# Altium schematic sheet 18_DDR3_TOP.SchDoc: DDR3 top
size A3; Organization: Lime Microsystems; Address1: Surrey Tech Centre; Address2: Guildford GU2 7YG; Address3: Surrey; Address4: United Kingdom; Revision: v1.2; SheetNumber: 16; SheetTotal: 27
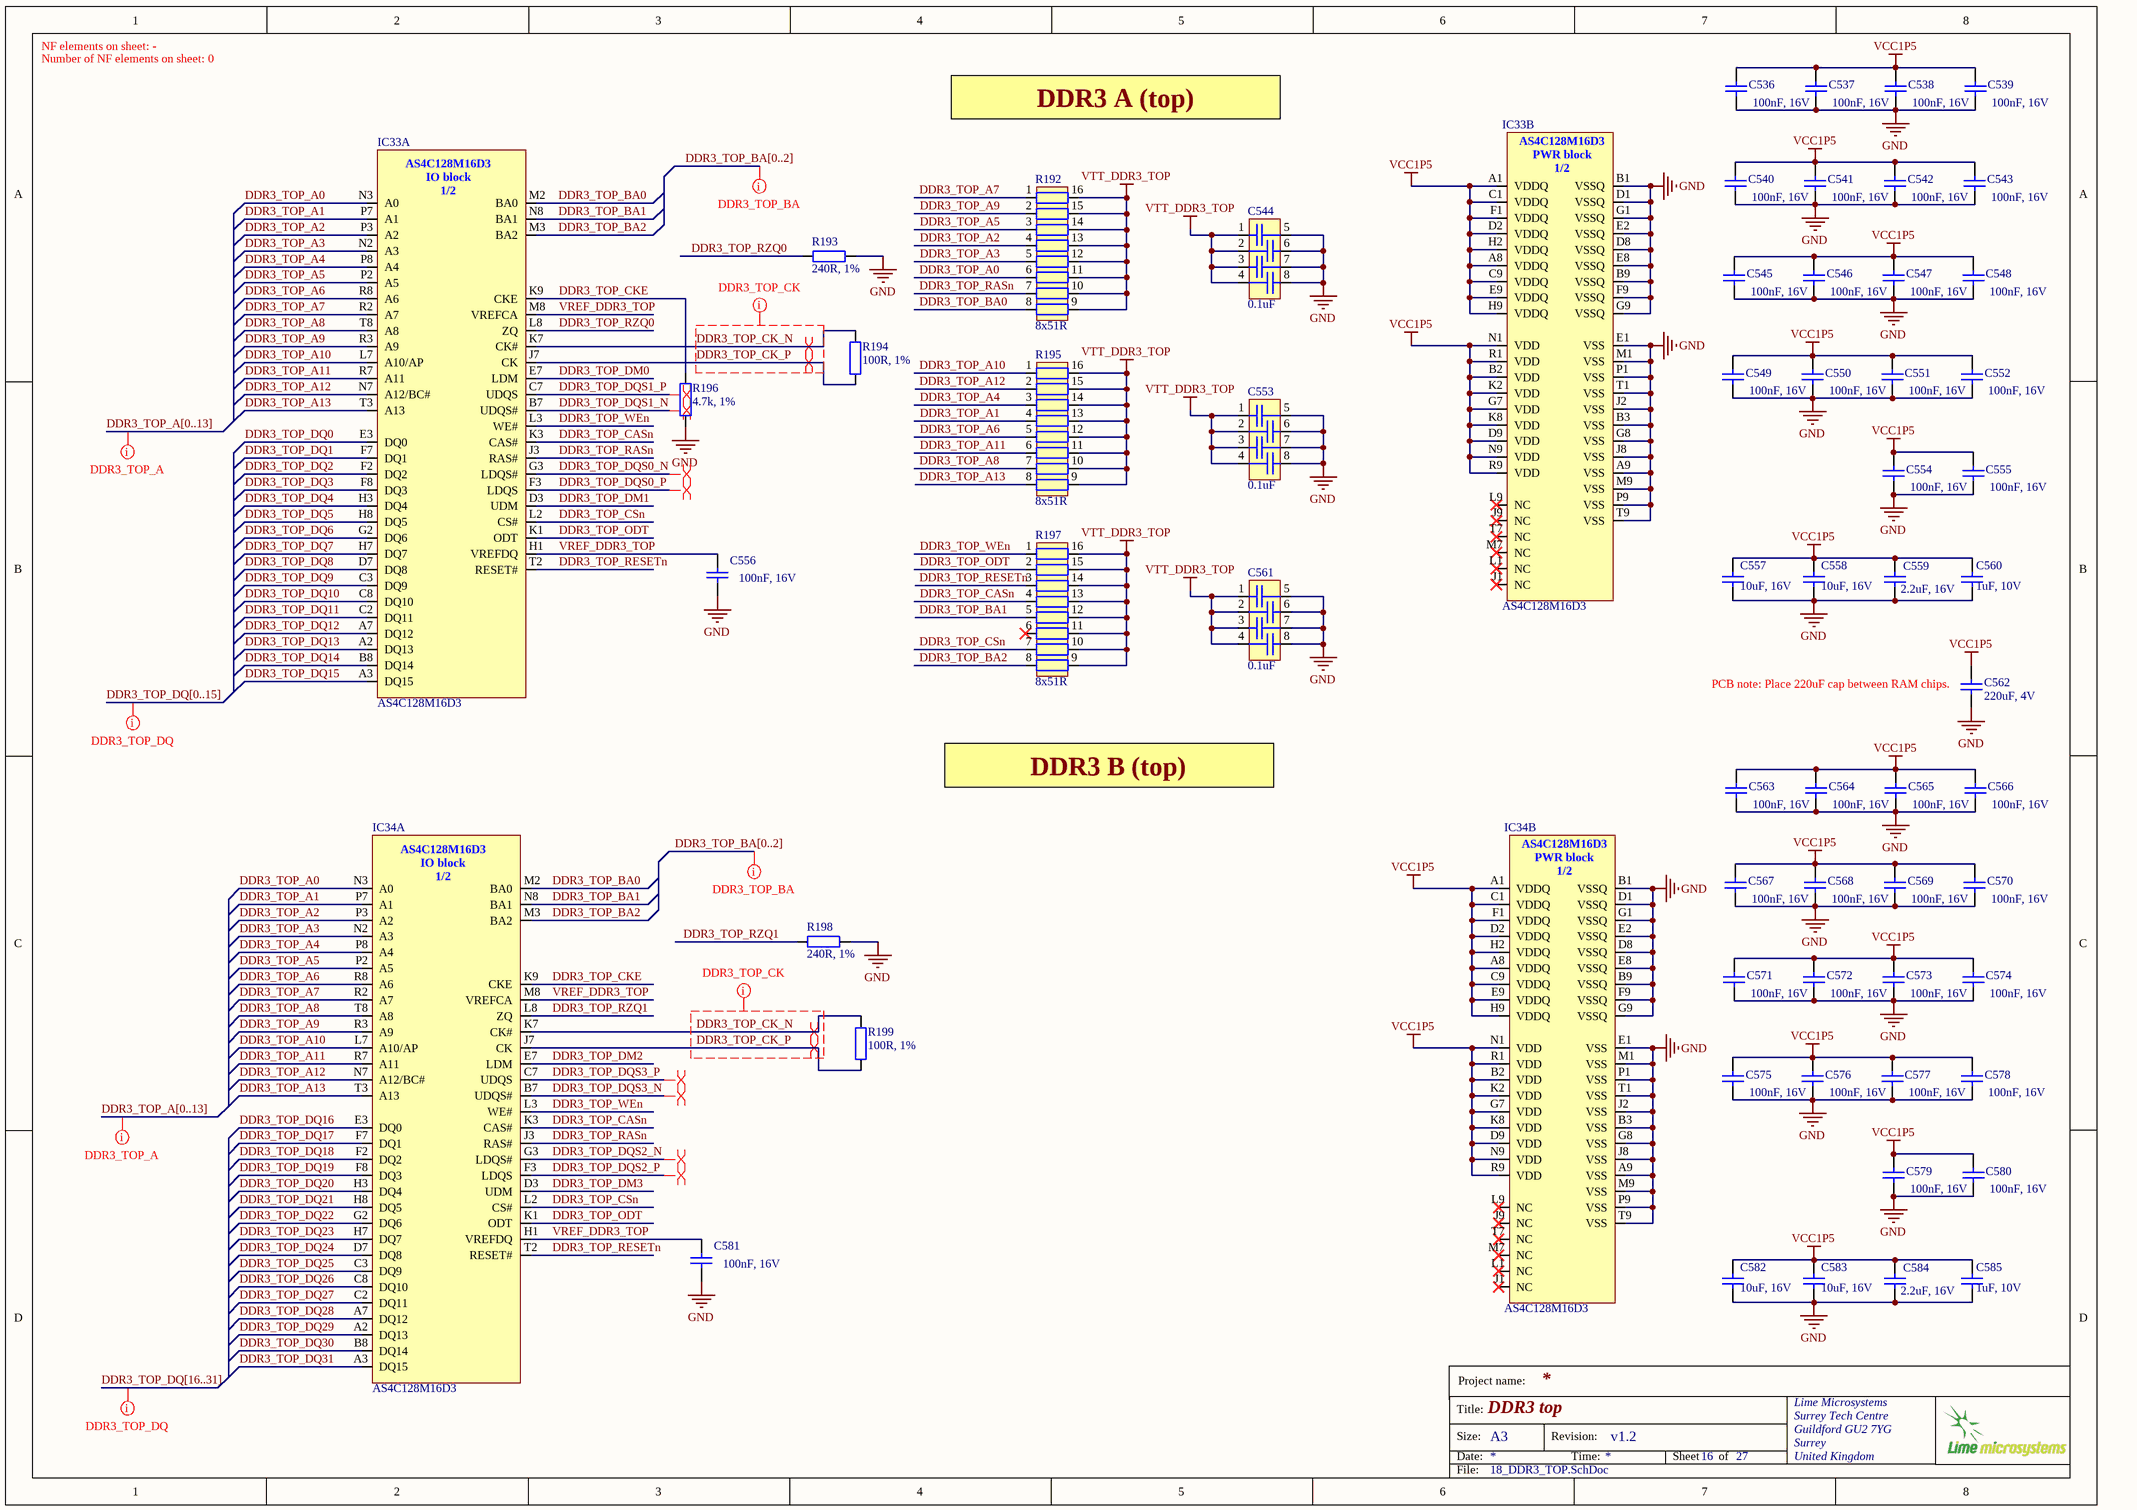
[diagram p0: 18_DDR3_TOP.SchDoc]

## Parts
C536  100nF, 16V  [CAP0402]
C537  100nF, 16V  [CAP0402]
C538  100nF, 16V  [CAP0402]
C539  100nF, 16V  [CAP0402]
C540  100nF, 16V  [CAP0402]
C541  100nF, 16V  [CAP0402]
C542  100nF, 16V  [CAP0402]
C543  100nF, 16V  [CAP0402]
C544  0.1uF  [CKCA43X7R1C104M100AA]
C545  100nF, 16V  [CAP0402]
C546  100nF, 16V  [CAP0402]
C547  100nF, 16V  [CAP0402]
C548  100nF, 16V  [CAP0402]
C549  100nF, 16V  [CAP0402]
C550  100nF, 16V  [CAP0402]
C551  100nF, 16V  [CAP0402]
C552  100nF, 16V  [CAP0402]
C553  0.1uF  [CKCA43X7R1C104M100AA]
C554  100nF, 16V  [CAP0402]
C555  100nF, 16V  [CAP0402]
C556  100nF, 16V  [CAP0402]
C557  10uF, 16V  [CAP0603]
C558  10uF, 16V  [CAP0603]
C559  2.2uF, 16V  [CAP0402]
C560  1uF, 10V  [CAP0402]
C561  0.1uF  [CKCA43X7R1C104M100AA]
C562  220uF, 4V  [CAP1206]
C563  100nF, 16V  [CAP0402]
C564  100nF, 16V  [CAP0402]
C565  100nF, 16V  [CAP0402]
C566  100nF, 16V  [CAP0402]
C567  100nF, 16V  [CAP0402]
C568  100nF, 16V  [CAP0402]
C569  100nF, 16V  [CAP0402]
C570  100nF, 16V  [CAP0402]
C571  100nF, 16V  [CAP0402]
C572  100nF, 16V  [CAP0402]
C573  100nF, 16V  [CAP0402]
C574  100nF, 16V  [CAP0402]
C575  100nF, 16V  [CAP0402]
C576  100nF, 16V  [CAP0402]
C577  100nF, 16V  [CAP0402]
C578  100nF, 16V  [CAP0402]
C579  100nF, 16V  [CAP0402]
C580  100nF, 16V  [CAP0402]
C581  100nF, 16V  [CAP0402]
C582  10uF, 16V  [CAP0603]
C583  10uF, 16V  [CAP0603]
C584  2.2uF, 16V  [CAP0402]
C585  1uF, 10V  [CAP0402]
IC33  AS4C128M16D3  [AS4C128M16D3]  (parts A,B of 2)
IC34  AS4C128M16D3  [AS4C128M16D3]  (parts A,B of 2)
R192  8x51R  [EXB2HV]
R193  240R, 1%  [RES0402]
R194  100R, 1%  [RES0402]
R195  8x51R  [EXB2HV]
R196  4.7k, 1%  [RES0402]
R197  8x51R  [EXB2HV]
R198  240R, 1%  [RES0402]
R199  100R, 1%  [RES0402]

## Nets
GND: C536.2 C537.2 C538.2 C539.2 C540.2 C541.2 C542.2 C543.2 C544.5 C544.6 C544.7 C544.8 C545.2 C546.2 C547.2 C548.2 C549.2 C550.2 C551.2 C552.2 C553.5 C553.6 C553.7 C553.8 C554.2 C555.2 C556.2 C557.1 C558.1 C559.2 C560.1 C561.5 C561.6 C561.7 C561.8 C562.1 C563.2 C564.2 C565.2 C566.2 C567.2 C568.2 C569.2 C570.2 C571.2 C572.2 C573.2 C574.2 C575.2 C576.2 C577.2 C578.2 C579.2 C580.2 C581.2 C582.1 C583.1 C584.2 C585.1 IC33.A9(VSS) IC33.B1(VSSQ) IC33.B3(VSS) IC33.B9(VSSQ) IC33.D1(VSSQ) IC33.D8(VSSQ) IC33.E1(VSS) IC33.E2(VSSQ) IC33.E8(VSSQ) IC33.F9(VSSQ) IC33.G1(VSSQ) IC33.G8(VSS) IC33.G9(VSSQ) IC33.J2(VSS) IC33.J8(VSS) IC33.M1(VSS) IC33.M9(VSS) IC33.P1(VSS) IC33.P9(VSS) IC33.T1(VSS) IC33.T9(VSS) IC34.A9(VSS) IC34.B1(VSSQ) IC34.B3(VSS) IC34.B9(VSSQ) IC34.D1(VSSQ) IC34.D8(VSSQ) IC34.E1(VSS) IC34.E2(VSSQ) IC34.E8(VSSQ) IC34.F9(VSSQ) IC34.G1(VSSQ) IC34.G8(VSS) IC34.G9(VSSQ) IC34.J2(VSS) IC34.J8(VSS) IC34.M1(VSS) IC34.M9(VSS) IC34.P1(VSS) IC34.P9(VSS) IC34.T1(VSS) IC34.T9(VSS) R193.2 R196.2 R198.2
VCC1P5: C536.1 C537.1 C538.1 C539.1 C540.1 C541.1 C542.1 C543.1 C545.1 C546.1 C547.1 C548.1 C549.1 C550.1 C551.1 C552.1 C554.1 C555.1 C557.2 C558.2 C559.1 C560.2 C562.2 C563.1 C564.1 C565.1 C566.1 C567.1 C568.1 C569.1 C570.1 C571.1 C572.1 C573.1 C574.1 C575.1 C576.1 C577.1 C578.1 C579.1 C580.1 C582.2 C583.2 C584.1 C585.2 IC33.A1(VDDQ) IC33.A8(VDDQ) IC33.B2(VDD) IC33.C1(VDDQ) IC33.C9(VDDQ) IC33.D2(VDDQ) IC33.D9(VDD) IC33.E9(VDDQ) IC33.F1(VDDQ) IC33.G7(VDD) IC33.H2(VDDQ) IC33.H9(VDDQ) IC33.K2(VDD) IC33.K8(VDD) IC33.N1(VDD) IC33.N9(VDD) IC33.R1(VDD) IC33.R9(VDD) IC34.A1(VDDQ) IC34.A8(VDDQ) IC34.B2(VDD) IC34.C1(VDDQ) IC34.C9(VDDQ) IC34.D2(VDDQ) IC34.D9(VDD) IC34.E9(VDDQ) IC34.F1(VDDQ) IC34.G7(VDD) IC34.H2(VDDQ) IC34.H9(VDDQ) IC34.K2(VDD) IC34.K8(VDD) IC34.N1(VDD) IC34.N9(VDD) IC34.R1(VDD) IC34.R9(VDD)
VTT_DDR3_TOP: C544.1 C544.2 C544.3 C544.4 C553.1 C553.2 C553.3 C553.4 C561.1 C561.2 C561.3 C561.4 R192.9 R192.10 R192.11 R192.12 R192.13 R192.14 R192.15 R192.16 R195.9 R195.10 R195.11 R195.12 R195.13 R195.14 R195.15 R195.16 R197.9 R197.10 R197.11 R197.12 R197.13 R197.14 R197.15 R197.16
DDR3_TOP_A0: IC33.N3(A0) IC34.N3(A0) R192.6
DDR3_TOP_A1: IC33.P7(A1) IC34.P7(A1) R195.4
DDR3_TOP_A2: IC33.P3(A2) IC34.P3(A2) R192.4
DDR3_TOP_A3: IC33.N2(A3) IC34.N2(A3) R192.5
DDR3_TOP_A4: IC33.P8(A4) IC34.P8(A4) R195.3
DDR3_TOP_A5: IC33.P2(A5) IC34.P2(A5) R192.3
DDR3_TOP_A6: IC33.R8(A6) IC34.R8(A6) R195.5
DDR3_TOP_A7: IC33.R2(A7) IC34.R2(A7) R192.1
DDR3_TOP_A8: IC33.T8(A8) IC34.T8(A8) R195.7
DDR3_TOP_A9: IC33.R3(A9) IC34.R3(A9) R192.2
DDR3_TOP_A10: IC33.L7(A10/AP) IC34.L7(A10/AP) R195.1
DDR3_TOP_A11: IC33.R7(A11) IC34.R7(A11) R195.6
DDR3_TOP_A12: IC33.N7(A12/BC#) IC34.N7(A12/BC#) R195.2
DDR3_TOP_A13: IC33.T3(A13) IC34.T3(A13) R195.8
DDR3_TOP_BA0: IC33.M2(BA0) IC34.M2(BA0) R192.8
DDR3_TOP_BA1: IC33.N8(BA1) IC34.N8(BA1) R197.5
DDR3_TOP_BA2: IC33.M3(BA2) IC34.M3(BA2) R197.8
DDR3_TOP_CASn: IC33.K3(CAS#) IC34.K3(CAS#) R197.4
DDR3_TOP_CK_N: IC33.K7(CK#) IC34.K7(CK#) R194.2 R199.2
DDR3_TOP_CK_P: IC33.J7(CK) IC34.J7(CK) R194.1 R199.1
DDR3_TOP_CKE: IC33.K9(CKE) IC34.K9(CKE) R196.1
DDR3_TOP_CSn: IC33.L2(CS#) IC34.L2(CS#) R197.7
DDR3_TOP_DM0: IC33.E7(LDM)
DDR3_TOP_DM1: IC33.D3(UDM)
DDR3_TOP_DM2: IC34.E7(LDM)
DDR3_TOP_DM3: IC34.D3(UDM)
DDR3_TOP_DQ0: IC33.E3(DQ0)
DDR3_TOP_DQ1: IC33.F7(DQ1)
DDR3_TOP_DQ2: IC33.F2(DQ2)
DDR3_TOP_DQ3: IC33.F8(DQ3)
DDR3_TOP_DQ4: IC33.H3(DQ4)
DDR3_TOP_DQ5: IC33.H8(DQ5)
DDR3_TOP_DQ6: IC33.G2(DQ6)
DDR3_TOP_DQ7: IC33.H7(DQ7)
DDR3_TOP_DQ8: IC33.D7(DQ8)
DDR3_TOP_DQ9: IC33.C3(DQ9)
DDR3_TOP_DQ10: IC33.C8(DQ10)
DDR3_TOP_DQ11: IC33.C2(DQ11)
DDR3_TOP_DQ12: IC33.A7(DQ12)
DDR3_TOP_DQ13: IC33.A2(DQ13)
DDR3_TOP_DQ14: IC33.B8(DQ14)
DDR3_TOP_DQ15: IC33.A3(DQ15)
DDR3_TOP_DQ16: IC34.E3(DQ0)
DDR3_TOP_DQ17: IC34.F7(DQ1)
DDR3_TOP_DQ18: IC34.F2(DQ2)
DDR3_TOP_DQ19: IC34.F8(DQ3)
DDR3_TOP_DQ20: IC34.H3(DQ4)
DDR3_TOP_DQ21: IC34.H8(DQ5)
DDR3_TOP_DQ22: IC34.G2(DQ6)
DDR3_TOP_DQ23: IC34.H7(DQ7)
DDR3_TOP_DQ24: IC34.D7(DQ8)
DDR3_TOP_DQ25: IC34.C3(DQ9)
DDR3_TOP_DQ26: IC34.C8(DQ10)
DDR3_TOP_DQ27: IC34.C2(DQ11)
DDR3_TOP_DQ28: IC34.A7(DQ12)
DDR3_TOP_DQ29: IC34.A2(DQ13)
DDR3_TOP_DQ30: IC34.B8(DQ14)
DDR3_TOP_DQ31: IC34.A3(DQ15)
DDR3_TOP_DQS0_N: IC33.G3(LDQS#)
DDR3_TOP_DQS0_P: IC33.F3(LDQS)
DDR3_TOP_DQS1_N: IC33.B7(UDQS#)
DDR3_TOP_DQS1_P: IC33.C7(UDQS)
DDR3_TOP_DQS2_N: IC34.G3(LDQS#)
DDR3_TOP_DQS2_P: IC34.F3(LDQS)
DDR3_TOP_DQS3_N: IC34.B7(UDQS#)
DDR3_TOP_DQS3_P: IC34.C7(UDQS)
DDR3_TOP_ODT: IC33.K1(ODT) IC34.K1(ODT) R197.2
DDR3_TOP_RASn: IC33.J3(RAS#) IC34.J3(RAS#) R192.7
DDR3_TOP_RESETn: IC33.T2(RESET#) IC34.T2(RESET#) R197.3
DDR3_TOP_RZQ0: IC33.L8(ZQ) R193.1
DDR3_TOP_RZQ1: IC34.L8(ZQ) R198.1
DDR3_TOP_WEn: IC33.L3(WE#) IC34.L3(WE#) R197.1
VREF_DDR3_TOP: C556.1 C581.1 IC33.H1(VREFDQ) IC33.M8(VREFCA) IC34.H1(VREFDQ) IC34.M8(VREFCA)

Not connected (* = marked no-connect by the designer): IC33 J1(NC)* J9(NC)* L1(NC)* L9(NC)* M7(NC)* T7(NC)*; IC34 J1(NC)* J9(NC)* L1(NC)* L9(NC)* M7(NC)* T7(NC)*; R197 6*

## Buses and harness runs
bus DDR3_TOP_A[0..13]
bus DDR3_TOP_BA[0..2]
bus DDR3_TOP_DQ[0..15]
bus DDR3_TOP_DQ[16..31]

## Layout directives
net class DDR3_TOP_DQ: (no net found under the mark)
net class DDR3_TOP_BA: (no net found under the mark)
net class DDR3_TOP_A: (no net found under the mark)
differential pair: DDR3_TOP_CK_N, DDR3_TOP_CK_P, DDR3_TOP_DQS0_N, DDR3_TOP_DQS0_P, DDR3_TOP_DQS1_N, DDR3_TOP_DQS1_P, DDR3_TOP_DQS2_N, DDR3_TOP_DQS2_P, DDR3_TOP_DQS3_N, DDR3_TOP_DQS3_P
net class DDR3_TOP_CK: (no net found under the mark), DDR3_TOP_CK_N, DDR3_TOP_CK_P

## Notes on the sheet
- NF elements on sheet: -
- Number of NF elements on sheet: 0
- DDR3 A (top)
- (near C562) PCB note: Place 220uF cap between RAM chips.
- DDR3 B (top)
- Project name:
- Title:
- Size:
- Date:
- A3
- Revision:
- Time:
- Sheet
- of
- File:
- (in symbol AS4C128M16D3, part A) AS4C128M16D3 / IO block / 1/2
- (in symbol AS4C128M16D3, part B) AS4C128M16D3 / PWR block / 1/2

## Library data of the parts
C536-C543 C545-C552 C554-C556 C563-C581 = Cap_0603: Part Description: 0.10µF ±10% 16V Ceramic Capacitor X7R 0402 (1005 Metric); Manufacturer Part Number 1: GRM155R71C104KA88D; Brand: Murata Electronics; Tolerance: 10 %; Type: General Purpose MLCC; Capacitance: 0.1 uF; Temperature Coefficient / Code: +/- 15 %; Case Height: 0.5 mm; Case Length: 1 mm; Dielectric: X7R; Supplier 1: Mouser; Supplier Part Number 1: 81-GRM155R71C104KA88; Case Code - in: 0402; Manufacturer: Murata Electronics; Category: Multilayer Ceramic Capacitors MLCC - SMD/SMT; Voltage Rating DC: 16 V; Value: 100nF, 16V; Case Code - mm: 1005; Case Width: 0.5 mm; Manufacturer Part Number: GRM155R71C104KA88D; Maximum Operating Temperature: + 125 C; Minimum Operating Temperature: - 55 C; Minimum Order Quantity: 1; Operating Temperature Range: - 55 C to + 125 C; Package / Case: 0402 (1005 metric); Packaging: Reel; Product: General Type MLCCs; Product Category: Low & Medium Capacitance SMD Ceramic Chip Capacitors; Reeling: True; RoHS - Mouser: Y; RoHS: RoHS Compliant; Series: GRM; Standard Pack Qty: 10000; Termination Style: SMD/SMT
C544 C553 C561 = 4X_cap_array_1206: Manufacturer: TDK; Part Description: 0.10µF ±20% Isolated Capacitor 4 Array 16V X7R 1206 (3216 Metric); Case Height: 1 mm; Case Length: 3.2 mm; Case Width: 1.6 mm; Voltage Rating: 16 V; Number of Elements: 4; Tolerance: 20 %; Temperature Coefficient / Code: X7R; Value: 0.1uF; Supplier 1: Mouser; Supplier Part Number 1: 810-CKCA43X7R1C104M; RoHS: RoHS Compliant; Termination Style: SMD/SMT; Brand: TDK; Category: Capacitor Arrays & Networks; Product: Ceramic Capacitor Arrays; Series: CKC; Packaging: Reel; Operating Temperature Range: - 55 C to + 125 C; Manufacturer Part Number 1: CKCA43X7R1C104M100AA; Capacitance: 0.1 uF; Product Category: Capacitor Arrays; Standard Pack Qty: 2000; RoHS - Mouser: Y; Minimum Order Quantity: 1; Reeling: True
C557 C558 C582 C583 = Cap_0603: Manufacturer Part Number 1: GRM188R61C106MA73D; Manufacturer: Yageo; Part Description: 10µF ±20% 16V Ceramic Capacitor X5R 0603 (1608 Metric); Capacitance: 10µF; Tolerance: ±20%; Temperature Coefficient: X5R; Supplier 1: Digi-Key; Supplier Part Number 1: 490-7201-2-ND; Package / Case: 0603 (1608 Metric); Category: Capacitors; Voltage - Rated: 16V; Value: 10uF, 16V; Applications: General Purpose; Features: -; Height - Seated (Max): -; Lead Spacing: -; Lead Style: -; Mounting Type: Surface Mount, MLCC; Operating Temperature: -55°C ~ 85°C; Packaging: Tape & Reel (TR); Ratings: -; RoHS: RoHS Compliant; Size / Dimension: 0.063" L x 0.031" W (1.60mm x 0.80mm); Thickness (Max): 0.039" (1.00mm)
C559 C584 = Cap_0603: CAP CER 2.2UF 16V 10% X5R 0402; Manufacturer Part Number 1: C1005X5R1C225K050BC; Part Description: 2.2µF ±10% 16V Ceramic Capacitor X5R 0402 (1005 Metric); Manufacturer: TDK Corporation; Capacitance: 2.2µF; Capacitor Case Style: 0402 [1005 Metric]; Value: 2.2uF, 16V; Supplier 1: Digi-Key; Supplier Part Number 1: 445-9085-6-ND; Tolerance: ±10%; Operating Temperature: -55°C ~ 85°C; Voltage - Rated: 16V; Category: Capacitors; Package / Case: 0402 (1005 Metric); Operating Temperature Range: -55°C to +85; Applications: General Purpose; Features: -; Height - Seated (Max): -; Lead Spacing: -; Lead Style: -; Mounting Type: Surface Mount, MLCC; Packaging: Tape & Reel (TR); Ratings: -; RoHS: RoHS Compliant; Size / Dimension: 0.039" L x 0.020" W (1.00mm x 0.50mm); Temperature Coefficient: X5R; Thickness (Max): 0.022" (0.55mm)
C560 C585 = Cap_0603: Manufacturer: TDK; Manufacturer Part Number 1: GRM155R61A105KE15J; Part Description: 1µF ±10% 10V Ceramic Capacitor X5R 0402 (1005 Metric); Capacitance: 1; Capacitance Tolerance: ± 10%; Ceramic Capacitor Case: 0402 [1005 Metric]; Dielectric Characteristic: X6; Product Range: TDK - C Series; Voltage Rating: 10; Supplier 1: Newark; Supplier Part Number 1: 490-6298-2-ND; Value: 1uF, 10V; MSL: -; RoHS: YES
C562 = Cap_1206: Manufacturer Part Number: GRM31CR60G227ME11L; Manufacturer: Murata Electronics North America; Part Description: 220µF ±20% 4V Ceramic Capacitor X5R 1206 (3216 Metric); Capacitance: 220µF; Temperature Coefficient: X5R; Tolerance: ±20%; Package / Case: 1206 (3216 Metric); Supplier 1: Digi-Key; Packaging: Cut Tape (CT); Size / Dimension: 0.126" L x 0.063" W (3.20mm x 1.60mm); Operating Temperature: -55°C ~ 85°C; Voltage - Rated: 4V; Mounting Type: Surface Mount, MLCC; Ratings: -; Supplier Part Number 1: 490-9774-1-ND; Category: Capacitors; Lead Spacing: -; Lead Style: -; Applications: General Purpose; Features: -; Height - Seated (Max): -; Thickness (Max): 0.075" (1.90mm); RoHS: RoHS Compliant; Value: 220uF, 4V; Manufacturer Part Number 1: GRM31CR60G227ME11L
IC33 IC34 = AS4C128M16D3: Manufacturer: Alliance Memory, Inc.; Manufacturer Part Number 1: AS4C128M16D3-12BCN; Part Description: IC SDRAM DDR3 128M X 16 96-FBGA; Memory Size: 2G (128M x 16); Interface: Parallel; Voltage - Supply: 1.425 V ~ 1.575 V; Format - Memory: RAM; Supplier 1: Digi-Key; Supplier Part Number 1: 1450-1083-ND; Supplier Device Package: 96-FBGA (13x9); Package / Case: 96-TFBGA; Supplier: Digi-Key; Category: Integrated Circuits (ICs)
R192 R195 R197 = 8X_resistor_array_0402: Manufacturer: PANASONIC ELECTRONIC COMPONENTS; Manufacturer Part Number 1: EXB2HV510JV; Part Description: RES ARRAY 8 RES 51 OHM 1506; Supplier 1: Farnell; Supplier Part Number 1: 2060069RL; Manufacturer: Panasonic Electronic Components
R193 R198 = Res_0402: Part Description: RES SMD 240 OHM 1% 1/16W 0402; Manufacturer Part Number 1: CRCW0402240RFKED; Manufacturer: Vishay Dale; Power (Watts): 0.063W, 1/16W; Temperature Coefficient: ±100ppm/°C; Resistance (Ohms): 240; Supplier 1: Digi-Key; Supplier Part Number 1: 541-240LDKR-ND; Tolerance: ±1%; Supplier Device Package: 0402 (1005 Metric); Category: Resistors; Value: 240R, 1%
R194 R199 = Res_0402: Manufacturer Part Number 1: RMCF0402FT100R; Part Description: RES SMD 100 OHM 1% 1/16W 0402; Manufacturer: Stackpole Electronics Inc.; Temperature Coefficient: ±100ppm/°C; Supplier 1: Digi-Key; Supplier Part Number 1: RMCF0402FT100RDKR-ND; Package / Case: 0402 (1005 Metric); Composition: Thick Film; Category: Resistors; Tolerance: ±1%; Value: 100R, 1%
R196 = Res_0402: Manufacturer: Yageo; Part Description: RES SMD 4.7K OHM 1% 1/16W 0402; Manufacturer Part Number1: RC0402FR-074K7L; Temperature Coefficient: ±100ppm/°C; Power (Watts): 0.063W, 1/16W; Number of Terminations: 2; Category: Resistors; Supplier 1: Digi-Key; Height: 0.016" (0.40mm); Features: Moisture Resistant; Size / Dimension: 0.039" L x 0.020" W (1.00mm x 0.50mm); Supplier Device Package: 0402; RoHS: RoHS Compliant; Composition: Thick Film; Package / Case: 0402 (1005 Metric); Resistance (Ohms): 4.7k; Operating Temperature: -55°C ~ 155°C; Tolerance: ±1%; Supplier Part Number 1: 311-4.7KLRCT-ND; Packaging: Cut Tape (CT); Value: 4.7k, 1%